# Altium schematic sheet Analog Input Noise Canceller.SchDoc
size A
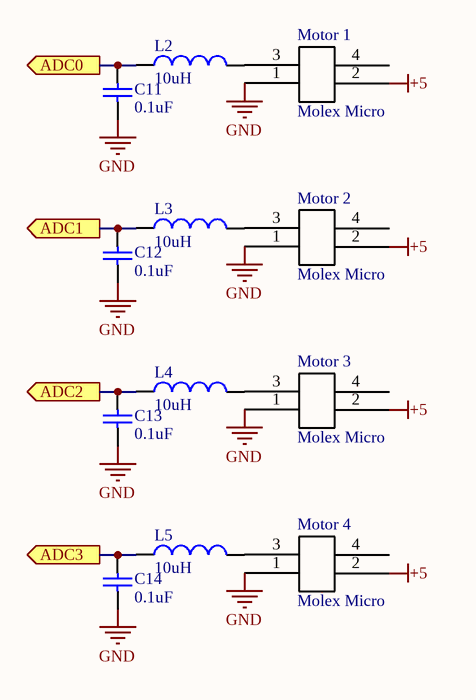
[diagram p0: Analog Input Noise Canceller.SchDoc]

## Parts
C11  0.1uF  [CAPC2013X94X50LL20T25]
C12  0.1uF  [CAPC2013X94X50LL20T25]
C13  0.1uF  [CAPC2013X94X50LL20T25]
C14  0.1uF  [CAPC2013X94X50LL20T25]
L2  10uH  [TDK-IND0805-125_V]
L3  10uH  [TDK-IND0805-125_V]
L4  10uH  [TDK-IND0805-125_V]
L5  10uH  [TDK-IND0805-125_V]
Motor_1  Molex Micro  [0430450427]
Motor_2  Molex Micro  [0430450427]
Motor_3  Molex Micro  [0430450427]
Motor_4  Molex Micro  [0430450427]

## Ports
ADC0 (out), ADC1 (out), ADC2 (out), ADC3 (out)

## Nets
+5: Motor_1.2 Motor_2.2 Motor_3.2 Motor_4.2
GND: C11.1 C12.1 C13.1 C14.1 Motor_1.1 Motor_2.1 Motor_3.1 Motor_4.1
ADC0: C11.2 L2.1 ; port ADC0
ADC1: C12.2 L3.1 ; port ADC1
ADC2: C13.2 L4.1 ; port ADC2
ADC3: C14.2 L5.1 ; port ADC3
NetL2_2: L2.2 Motor_1.3
NetL3_2: L3.2 Motor_2.3
NetL4_2: L4.2 Motor_3.3
NetL5_2: L5.2 Motor_4.3

Not connected (* = marked no-connect by the designer): Motor_1 4; Motor_2 4; Motor_3 4; Motor_4 4

## Library data of the parts
C11-C14 = CMP-2000-05808-1: Chip Capacitor, 0.1 uF, +/- 5%, 50 V, -55 to 125 degC, 0805 (2012 Metric), RoHS, Tape and Reel; Case Width: 1.25mm; Case Length: 2.01mm; Case Height: 0.94mm; Brand: AVX; Type: StandardX7RMLCCs; Capacitance - nF: 100nF; Dissipation Factor DF: 2.5; Voltage Rating DC: 50V; Temperature Coefficient / Code: +/-15%; Capacitance - pF: 100000pF; Dielectric: X7R; Dimensions: 1.25mmWx2.01mmLx0.94mmH; Product: GeneralTypeMLCCs; Package Description: 2-Pin Surface Mount Device, Body 2.01 x 1.25 mm; Capacitance: 0.1uF; Package / Case: 0805(2012metric); Product Category: MultilayerCeramicCapacitorsMLCC-SMD/SMT; Case Code - mm: 2012; Packaging: Reel; Manufacturer URL: http://www.avx.com/; Operating Temperature Range: -55Cto+125C; Termination Style: SMD/SMT; Maximum Operating Temperature: +125C; Case Code - in: 0805; Minimum Operating Temperature: -55C; Factory Pack Quantity: 4000; RoHS: Details; Voltage Rating: 50V; Tolerance: 5%; Package Reference: 0805; Datasheet URL: http://www.farnell.com/datasheets/1679506.pdf; Manufacturer: AVX; Mounting Technology: SurfaceMount; Datasheet Version: 11/2012
L2-L5 = CMP-0266-00001-1: Multilayer Inductor, 10 uH, ±20%, 300 mOhm, 50MHz, 0805(2012); PartNumber: MLZ2012N100LT; DC Resistance: 0.3 Ohm; PackageReference: IND0805-125; ComponentLink1URL: http://www.global.tdk.com/; DatasheetVersion: 05/2013; ComponentLink2Description: Datasheet; ComponentLink1Description: Manufacturer URL; Mounting Technology: Suface Mount; ComponentLink2URL: http://www.tdk.co.jp/tcfx01/c533_mlz.pdf; PackageDescription: 2-Pin SMT Inductor, 2 x 1.25 mm Body
Motor_1-Motor_4 = Molex micro-fit 4-pin (dual row schematic): Molex micro-fit 3.0, P/N 0430450427